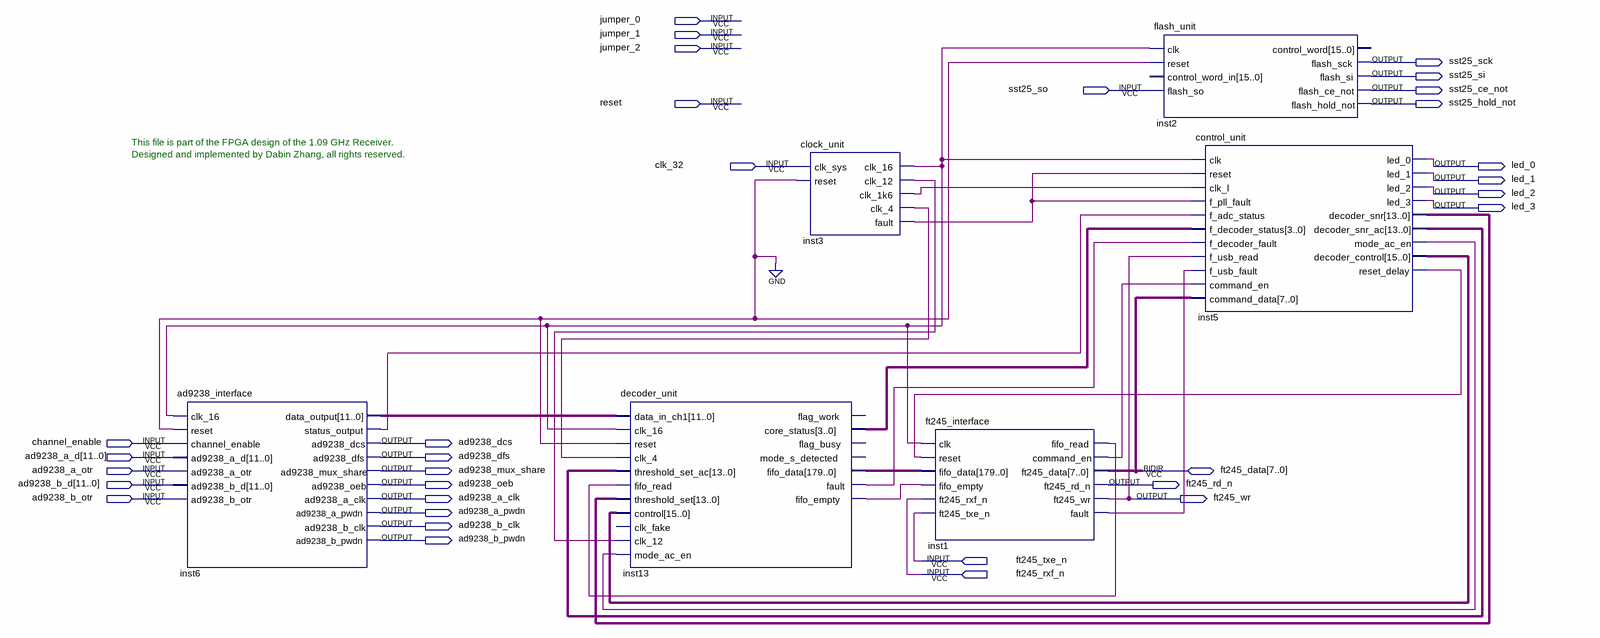
[diagram p0: schematic sheet]
// Quartus schematic receiver.bdf as structural Verilog: 6 symbols, 32 pins
module receiver (
  input  jumper_0,
  input  jumper_1,
  input  jumper_2,
  input  sst25_so,
  input  reset,
  input  clk_32,
  input  channel_enable,
  input  [11:0] ad9238_a_d,
  input  ad9238_a_otr,
  input  [11:0] ad9238_b_d,
  input  ad9238_b_otr,
  input  ft245_txe_n,
  input  ft245_rxf_n,
  inout  [7:0] ft245_data,
  output sst25_sck,
  output sst25_si,
  output sst25_ce_not,
  output sst25_hold_not,
  output led_0,
  output led_1,
  output led_2,
  output led_3,
  output ad9238_dcs,
  output ad9238_dfs,
  output ad9238_mux_share,
  output ad9238_oeb,
  output ft245_rd_n,
  output ad9238_a_clk,
  output ft245_wr,
  output ad9238_a_pwdn,
  output ad9238_b_clk,
  output ad9238_b_pwdn
);

  wire inst1_command_en, inst1_fault, inst1_fifo_read, inst3_clk_1k6, inst3_clk_4, inst3_clk_12,
       inst3_clk_16, inst3_fault, inst5_mode_ac_en, inst5_reset_delay, inst6_status_output, inst13_fault,
       inst13_fifo_empty;
  wire [3:0] inst13_core_status;
  wire [11:0] inst6_data_output;
  wire [13:0] inst5_decoder_snr, inst5_decoder_snr_ac;
  wire [15:0] inst5_decoder_control;
  wire [179:0] inst13_fifo_data;

  ad9238_interface inst6 (
    .clk_16(inst3_clk_16), .reset(1'b0), .channel_enable(channel_enable), .ad9238_a_d(ad9238_a_d),
    .ad9238_a_otr(ad9238_a_otr), .ad9238_b_d(ad9238_b_d), .ad9238_b_otr(ad9238_b_otr),
    .data_output(inst6_data_output), .status_output(inst6_status_output), .ad9238_dcs(ad9238_dcs),
    .ad9238_dfs(ad9238_dfs), .ad9238_mux_share(ad9238_mux_share), .ad9238_oeb(ad9238_oeb),
    .ad9238_a_clk(ad9238_a_clk), .ad9238_a_pwdn(ad9238_a_pwdn), .ad9238_b_clk(ad9238_b_clk),
    .ad9238_b_pwdn(ad9238_b_pwdn));
  decoder_unit inst13 (
    .data_in_ch1(inst6_data_output), .clk_16(inst3_clk_16), .reset(1'b0), .clk_4(inst3_clk_4),
    .threshold_set_ac(inst5_decoder_snr_ac), .fifo_read(inst1_fifo_read), .threshold_set(inst5_decoder_snr),
    .control(inst5_decoder_control), .clk_12(inst3_clk_12), .mode_ac_en(inst5_mode_ac_en),
    .core_status(inst13_core_status), .fifo_data(inst13_fifo_data), .fault(inst13_fault),
    .fifo_empty(inst13_fifo_empty));  // open: clk_fake, flag_work, flag_busy, mode_s_detected
  clock_unit inst3 (
    .clk_sys(clk_32), .reset(1'b0), .clk_16(inst3_clk_16), .clk_12(inst3_clk_12), .clk_1k6(inst3_clk_1k6),
    .clk_4(inst3_clk_4), .fault(inst3_fault));
  ft245_interface inst1 (
    .clk(inst3_clk_16), .reset(inst5_reset_delay), .fifo_data(inst13_fifo_data),
    .fifo_empty(inst13_fifo_empty), .ft245_rxf_n(ft245_rxf_n), .ft245_txe_n(ft245_txe_n),
    .fifo_read(inst1_fifo_read), .command_en(inst1_command_en), .ft245_data(ft245_data),
    .ft245_rd_n(ft245_rd_n), .ft245_wr(ft245_wr), .fault(inst1_fault));
  flash_unit inst2 (
    .clk(inst3_clk_16), .reset(1'b0), .flash_so(sst25_so), .flash_sck(sst25_sck), .flash_si(sst25_si),
    .flash_ce_not(sst25_ce_not), .flash_hold_not(sst25_hold_not));  // open: control_word_in, control_word
  control_unit inst5 (
    .clk(inst3_clk_16), .reset(inst3_fault), .clk_l(inst3_clk_1k6), .f_pll_fault(inst3_fault),
    .f_adc_status(inst6_status_output), .f_decoder_status(inst13_core_status),
    .f_decoder_fault(inst13_fault), .f_usb_read(ft245_wr), .f_usb_fault(inst1_fault),
    .command_en(inst1_command_en), .command_data(ft245_data), .led_0(led_0), .led_1(led_1), .led_2(led_2),
    .led_3(led_3), .decoder_snr(inst5_decoder_snr), .decoder_snr_ac(inst5_decoder_snr_ac),
    .mode_ac_en(inst5_mode_ac_en), .decoder_control(inst5_decoder_control), .reset_delay(inst5_reset_delay));

  // Notes on the sheet:
  //   This file is part of the FPGA design of the 1.09 GHz Receiver.
  //   Designed and implemented by Dabin Zhang, all rights reserved.
endmodule
